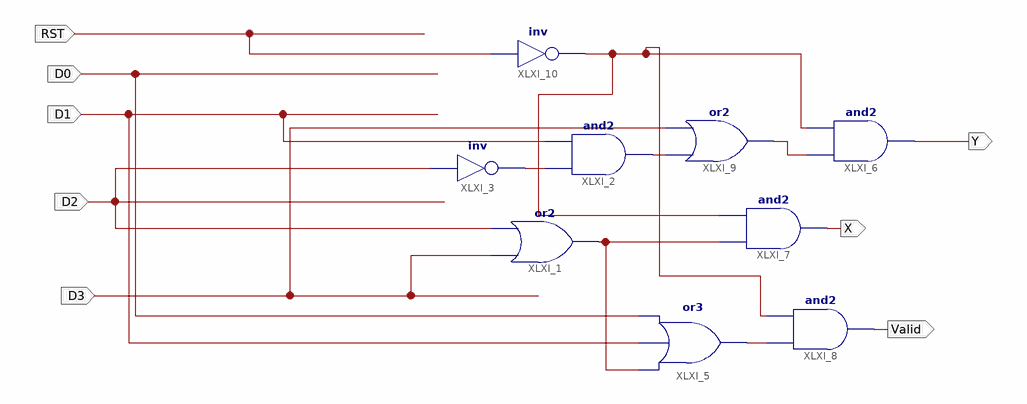
[diagram p0: schematic sheet 1]
// Xilinx ISE schematic priority_encoder4to2.sch (artix7) as structural Verilog: 9 symbols, 8 ports
module priority_encoder4to2 (
  input  D0,
  input  D1,
  input  D2,
  input  D3,
  input  RST,
  output Y,
  output X,
  output Valid
);

  wire XLXN_9, XLXN_18, XLXN_26, XLXN_38, XLXN_39, XLXN_43;

  or XLXI_1 (XLXN_18, D3, D2);
  and XLXI_2 (XLXN_38, XLXN_9, D1);
  not XLXI_3 (XLXN_9, D2);
  or XLXI_5 (XLXN_26, XLXN_18, D1, D0);
  and XLXI_6 (Y, XLXN_39, XLXN_43);
  and XLXI_7 (X, XLXN_18, XLXN_43);
  and XLXI_8 (Valid, XLXN_26, XLXN_43);
  or XLXI_9 (XLXN_39, XLXN_38, D3);
  not XLXI_10 (XLXN_43, RST);
endmodule
